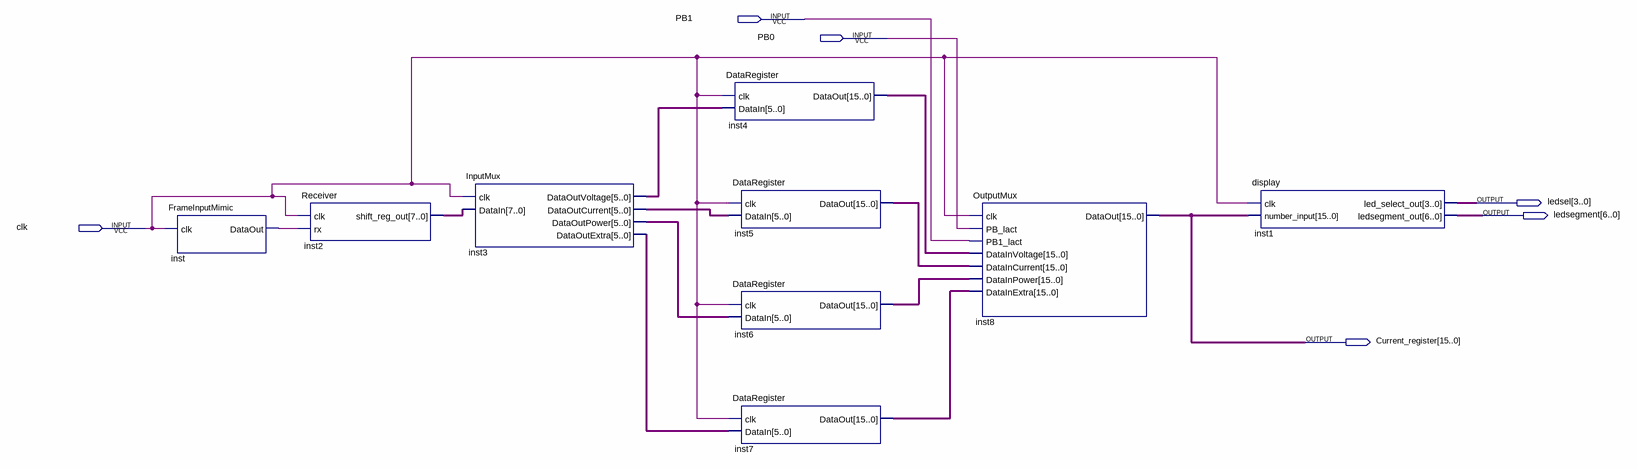
[diagram p0: schematic sheet]
// Quartus schematic FullBaseStation.bdf as structural Verilog: 9 symbols, 6 pins
module FullBaseStation (
  input  PB1,
  input  PB0,
  input  clk,
  output [3:0] ledsel,
  output [6:0] ledsegment,
  output [15:0] Current_register
);

  wire inst_dataout;
  wire [5:0] inst3_dataoutcurrent, inst3_dataoutextra, inst3_dataoutpower, inst3_dataoutvoltage;
  wire [7:0] inst2_shift_reg_out;
  wire [15:0] inst4_dataout, inst5_dataout, inst6_dataout, inst7_dataout;

  FrameInputMimic inst (.clk(clk), .DataOut(inst_dataout));
  Receiver inst2 (.clk(clk), .rx(inst_dataout), .shift_reg_out(inst2_shift_reg_out));
  InputMux inst3 (
    .clk(clk), .DataIn(inst2_shift_reg_out), .DataOutVoltage(inst3_dataoutvoltage),
    .DataOutCurrent(inst3_dataoutcurrent), .DataOutPower(inst3_dataoutpower),
    .DataOutExtra(inst3_dataoutextra));
  DataRegister inst4 (.clk(clk), .DataIn(inst3_dataoutvoltage), .DataOut(inst4_dataout));
  DataRegister inst5 (.clk(clk), .DataIn(inst3_dataoutcurrent), .DataOut(inst5_dataout));
  DataRegister inst6 (.clk(clk), .DataIn(inst3_dataoutpower), .DataOut(inst6_dataout));
  DataRegister inst7 (.clk(clk), .DataIn(inst3_dataoutextra), .DataOut(inst7_dataout));
  OutputMux inst8 (
    .clk(clk), .PB_lact(PB0), .PB1_lact(PB1), .DataInVoltage(inst4_dataout), .DataInCurrent(inst5_dataout),
    .DataInPower(inst6_dataout), .DataInExtra(inst7_dataout), .DataOut(Current_register));
  display inst1 (.clk(clk), .number_input(Current_register), .led_select_out(ledsel), .ledsegment_out(ledsegment));
endmodule
